# Altium schematic sheet GS_02_Pow.SchDoc: Title
size A1; Date: Date; CompanyName: Integrated Micro-Electronics Bulgaria; Organization: Design & Development Department; Address1: Drawing Type; Address2: Address 1; Address3: Address 2; Address4: Address 3; DocumentNumber: 730xxx; Revision: 01; SheetNumber: 1; SheetTotal: 1; PageSetup: Record=PageOptions|CenterHorizontal=True|CenterVertical=True|PrintScale=0.70|XCorrection=1.00|YCorrection=1.00|PrintKind=2|BorderSize=5000000|LeftOffset=0|BottomOffset=0|Orientation=2|PaperLength=1000|PaperWidth=1000|Scale=100|PaperSource=7|PrintQuality=-4|MediaType=1|DitherType=10|PaperKind=A4|PrintScaleMode=1; SheetSize: A3; Time: Time; ModifiedDate: Mod. Date
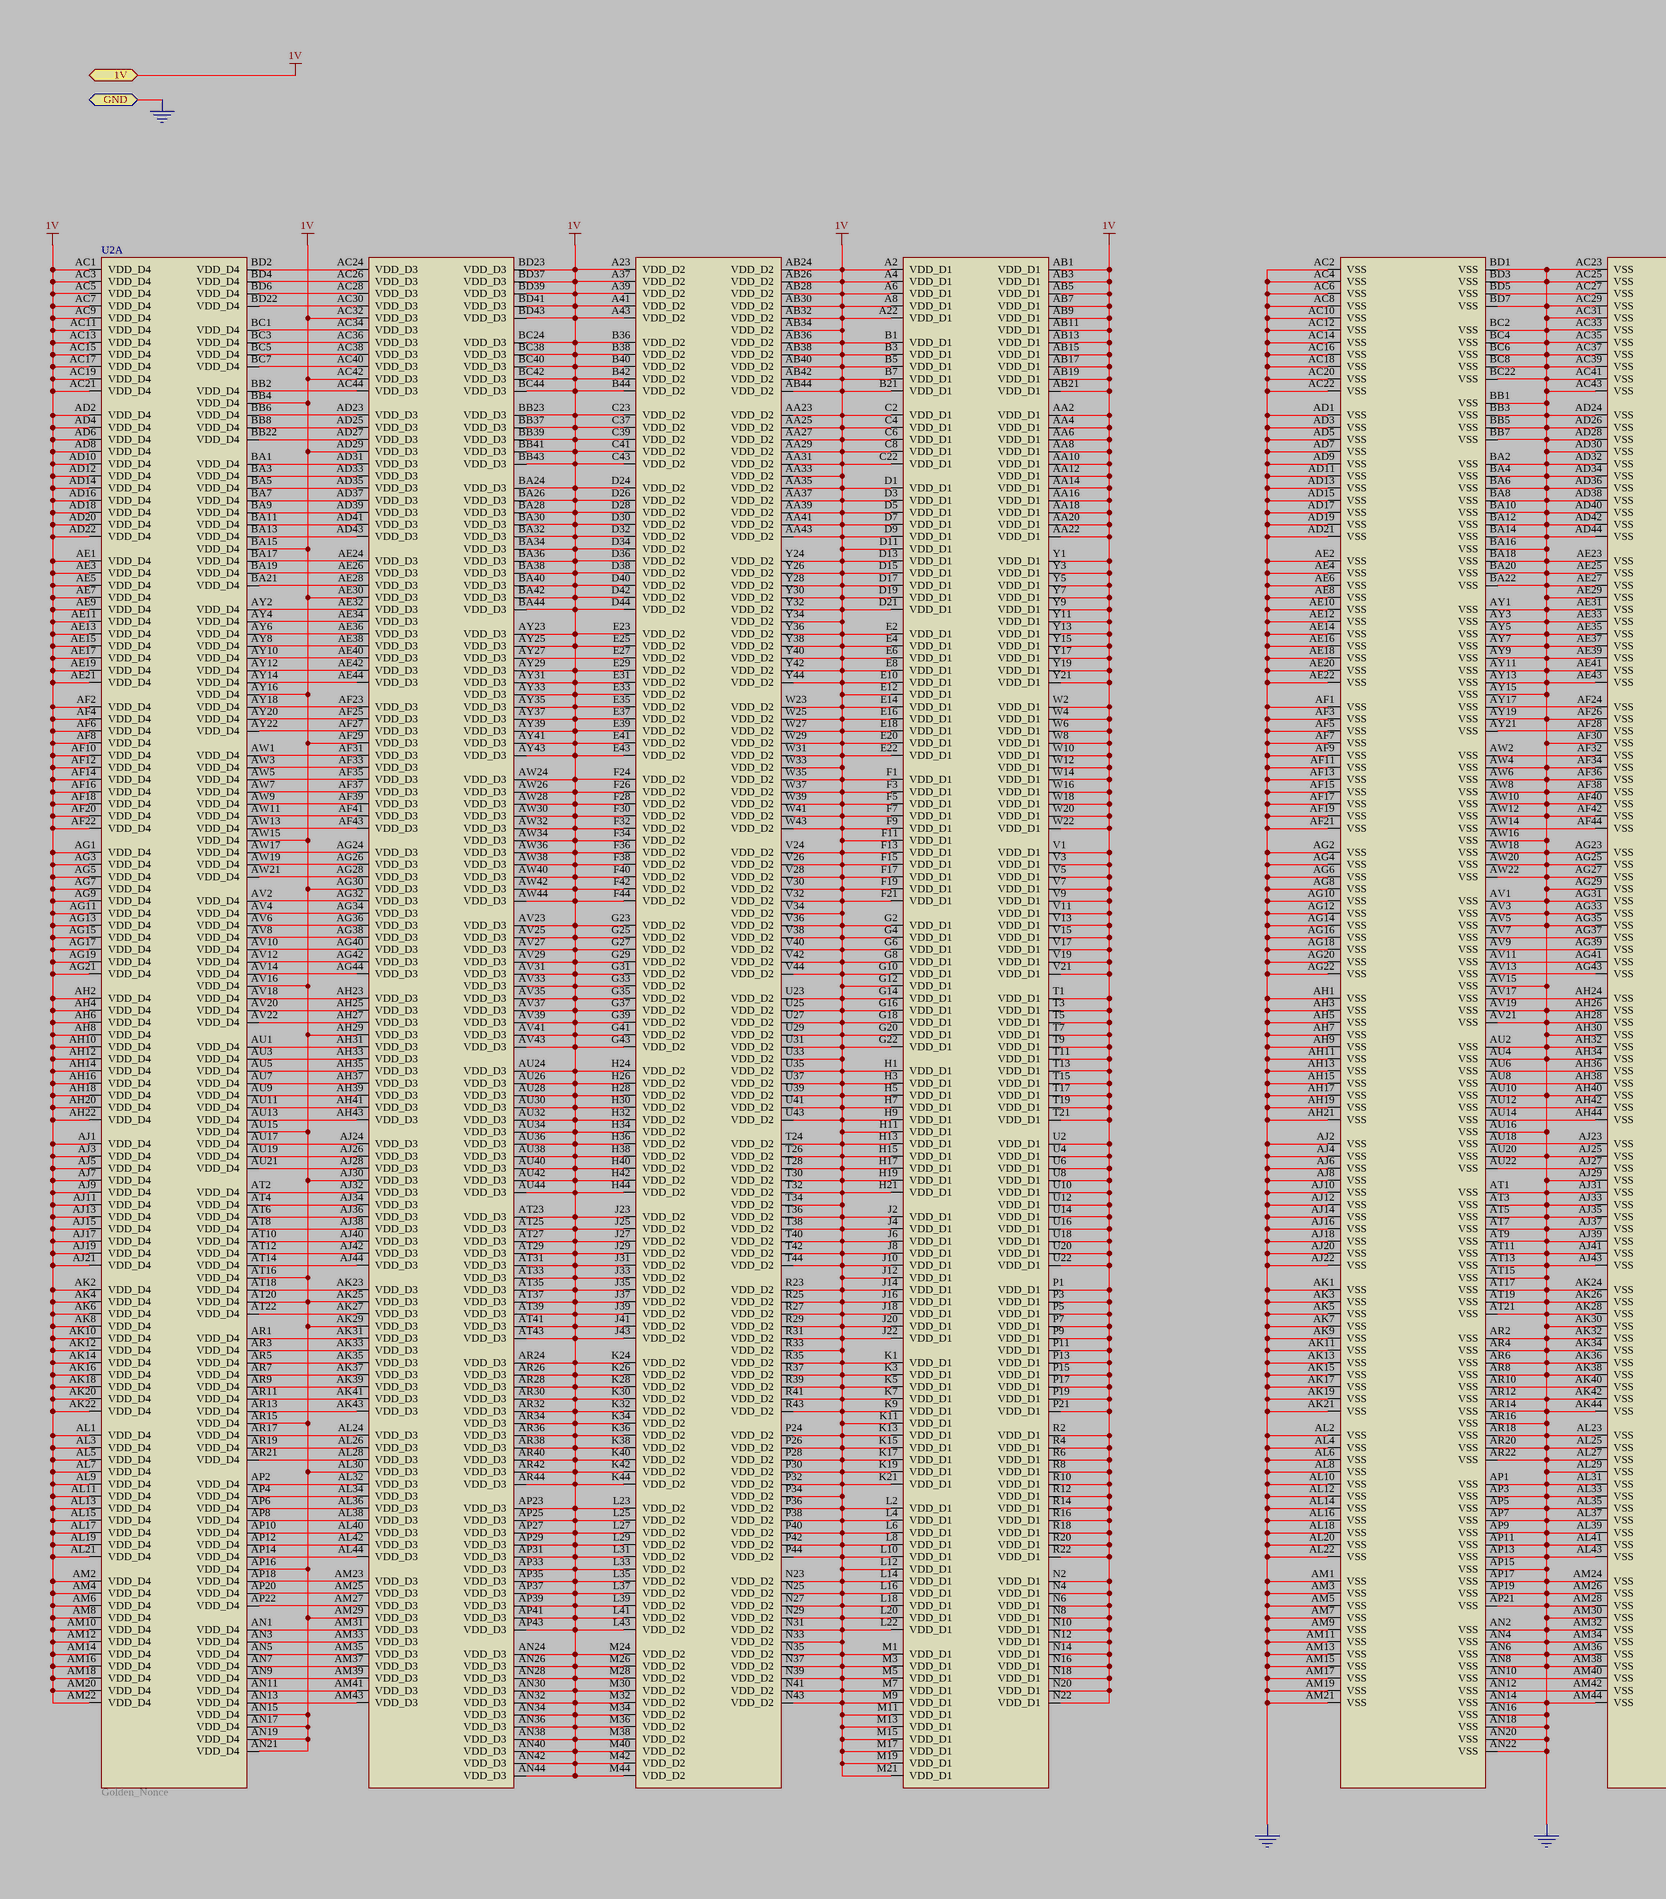
[diagram p0: GS_02_Pow.SchDoc, left]
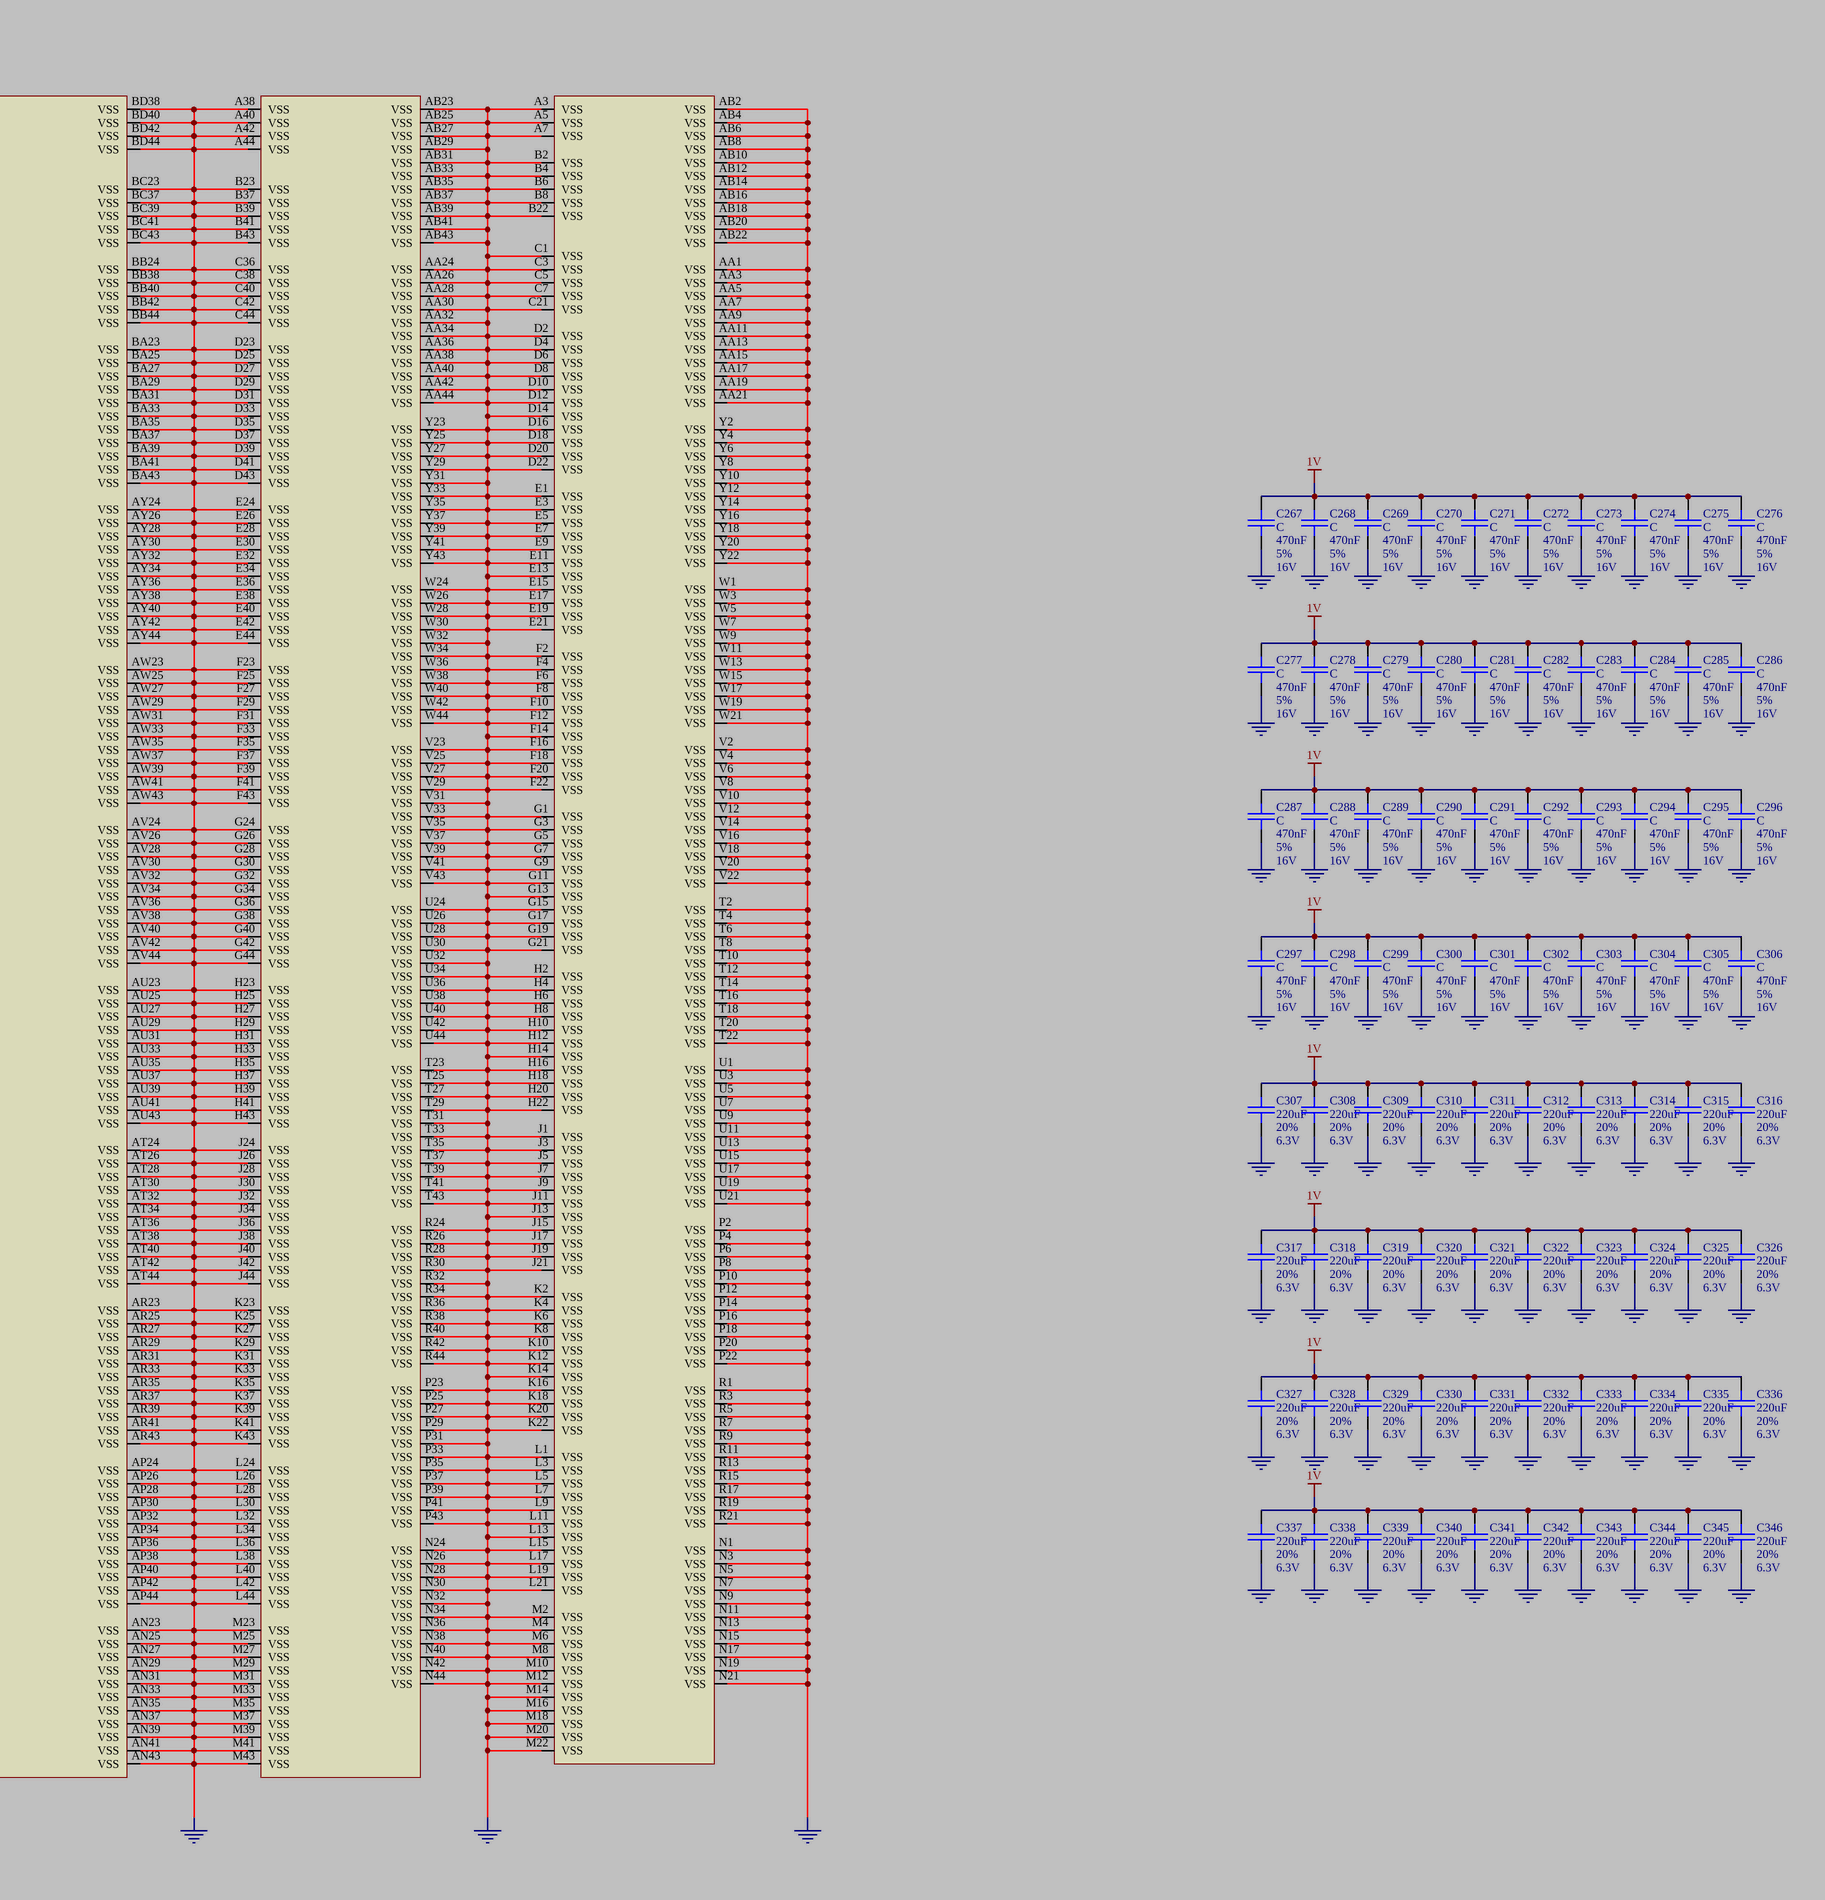
[diagram p1: GS_02_Pow.SchDoc, right]

## Parts
C267  C  DB_VALUE: 470nF  DB_TOLERANCE: 5%  DB_VOLTAGE: 16V  [SMD_0603_CAPC1608X95N]
C268  C  DB_VALUE: 470nF  DB_TOLERANCE: 5%  DB_VOLTAGE: 16V  [SMD_0603_CAPC1608X95N]
C269  C  DB_VALUE: 470nF  DB_TOLERANCE: 5%  DB_VOLTAGE: 16V  [SMD_0603_CAPC1608X95N]
C270  C  DB_VALUE: 470nF  DB_TOLERANCE: 5%  DB_VOLTAGE: 16V  [SMD_0603_CAPC1608X95N]
C271  C  DB_VALUE: 470nF  DB_TOLERANCE: 5%  DB_VOLTAGE: 16V  [SMD_0603_CAPC1608X95N]
C272  C  DB_VALUE: 470nF  DB_TOLERANCE: 5%  DB_VOLTAGE: 16V  [SMD_0603_CAPC1608X95N]
C273  C  DB_VALUE: 470nF  DB_TOLERANCE: 5%  DB_VOLTAGE: 16V  [SMD_0603_CAPC1608X95N]
C274  C  DB_VALUE: 470nF  DB_TOLERANCE: 5%  DB_VOLTAGE: 16V  [SMD_0603_CAPC1608X95N]
C275  C  DB_VALUE: 470nF  DB_TOLERANCE: 5%  DB_VOLTAGE: 16V  [SMD_0603_CAPC1608X95N]
C276  C  DB_VALUE: 470nF  DB_TOLERANCE: 5%  DB_VOLTAGE: 16V  [SMD_0603_CAPC1608X95N]
C277  C  DB_VALUE: 470nF  DB_TOLERANCE: 5%  DB_VOLTAGE: 16V  [SMD_0603_CAPC1608X95N]
C278  C  DB_VALUE: 470nF  DB_TOLERANCE: 5%  DB_VOLTAGE: 16V  [SMD_0603_CAPC1608X95N]
C279  C  DB_VALUE: 470nF  DB_TOLERANCE: 5%  DB_VOLTAGE: 16V  [SMD_0603_CAPC1608X95N]
C280  C  DB_VALUE: 470nF  DB_TOLERANCE: 5%  DB_VOLTAGE: 16V  [SMD_0603_CAPC1608X95N]
C281  C  DB_VALUE: 470nF  DB_TOLERANCE: 5%  DB_VOLTAGE: 16V  [SMD_0603_CAPC1608X95N]
C282  C  DB_VALUE: 470nF  DB_TOLERANCE: 5%  DB_VOLTAGE: 16V  [SMD_0603_CAPC1608X95N]
C283  C  DB_VALUE: 470nF  DB_TOLERANCE: 5%  DB_VOLTAGE: 16V  [SMD_0603_CAPC1608X95N]
C284  C  DB_VALUE: 470nF  DB_TOLERANCE: 5%  DB_VOLTAGE: 16V  [SMD_0603_CAPC1608X95N]
C285  C  DB_VALUE: 470nF  DB_TOLERANCE: 5%  DB_VOLTAGE: 16V  [SMD_0603_CAPC1608X95N]
C286  C  DB_VALUE: 470nF  DB_TOLERANCE: 5%  DB_VOLTAGE: 16V  [SMD_0603_CAPC1608X95N]
C287  C  DB_VALUE: 470nF  DB_TOLERANCE: 5%  DB_VOLTAGE: 16V  [SMD_0603_CAPC1608X95N]
C288  C  DB_VALUE: 470nF  DB_TOLERANCE: 5%  DB_VOLTAGE: 16V  [SMD_0603_CAPC1608X95N]
C289  C  DB_VALUE: 470nF  DB_TOLERANCE: 5%  DB_VOLTAGE: 16V  [SMD_0603_CAPC1608X95N]
C290  C  DB_VALUE: 470nF  DB_TOLERANCE: 5%  DB_VOLTAGE: 16V  [SMD_0603_CAPC1608X95N]
C291  C  DB_VALUE: 470nF  DB_TOLERANCE: 5%  DB_VOLTAGE: 16V  [SMD_0603_CAPC1608X95N]
C292  C  DB_VALUE: 470nF  DB_TOLERANCE: 5%  DB_VOLTAGE: 16V  [SMD_0603_CAPC1608X95N]
C293  C  DB_VALUE: 470nF  DB_TOLERANCE: 5%  DB_VOLTAGE: 16V  [SMD_0603_CAPC1608X95N]
C294  C  DB_VALUE: 470nF  DB_TOLERANCE: 5%  DB_VOLTAGE: 16V  [SMD_0603_CAPC1608X95N]
C295  C  DB_VALUE: 470nF  DB_TOLERANCE: 5%  DB_VOLTAGE: 16V  [SMD_0603_CAPC1608X95N]
C296  C  DB_VALUE: 470nF  DB_TOLERANCE: 5%  DB_VOLTAGE: 16V  [SMD_0603_CAPC1608X95N]
C297  C  DB_VALUE: 470nF  DB_TOLERANCE: 5%  DB_VOLTAGE: 16V  [SMD_0603_CAPC1608X95N]
C298  C  DB_VALUE: 470nF  DB_TOLERANCE: 5%  DB_VOLTAGE: 16V  [SMD_0603_CAPC1608X95N]
C299  C  DB_VALUE: 470nF  DB_TOLERANCE: 5%  DB_VOLTAGE: 16V  [SMD_0603_CAPC1608X95N]
C300  C  DB_VALUE: 470nF  DB_TOLERANCE: 5%  DB_VOLTAGE: 16V  [SMD_0603_CAPC1608X95N]
C301  C  DB_VALUE: 470nF  DB_TOLERANCE: 5%  DB_VOLTAGE: 16V  [SMD_0603_CAPC1608X95N]
C302  C  DB_VALUE: 470nF  DB_TOLERANCE: 5%  DB_VOLTAGE: 16V  [SMD_0603_CAPC1608X95N]
C303  C  DB_VALUE: 470nF  DB_TOLERANCE: 5%  DB_VOLTAGE: 16V  [SMD_0603_CAPC1608X95N]
C304  C  DB_VALUE: 470nF  DB_TOLERANCE: 5%  DB_VOLTAGE: 16V  [SMD_0603_CAPC1608X95N]
C305  C  DB_VALUE: 470nF  DB_TOLERANCE: 5%  DB_VOLTAGE: 16V  [SMD_0603_CAPC1608X95N]
C306  C  DB_VALUE: 470nF  DB_TOLERANCE: 5%  DB_VOLTAGE: 16V  [SMD_0603_CAPC1608X95N]
C307  DB_VALUE: 220uF  DB_TOLERANCE: 20%  DB_VOLTAGE: 6.3V  [SMD_1210_CAPC3225X279N]  (hidden comment: C)
C308  DB_VALUE: 220uF  DB_TOLERANCE: 20%  DB_VOLTAGE: 6.3V  [SMD_1210_CAPC3225X279N]  (hidden comment: C)
C309  DB_VALUE: 220uF  DB_TOLERANCE: 20%  DB_VOLTAGE: 6.3V  [SMD_1210_CAPC3225X279N]  (hidden comment: C)
C310  DB_VALUE: 220uF  DB_TOLERANCE: 20%  DB_VOLTAGE: 6.3V  [SMD_1210_CAPC3225X279N]  (hidden comment: C)
C311  DB_VALUE: 220uF  DB_TOLERANCE: 20%  DB_VOLTAGE: 6.3V  [SMD_1210_CAPC3225X279N]  (hidden comment: C)
C312  DB_VALUE: 220uF  DB_TOLERANCE: 20%  DB_VOLTAGE: 6.3V  [SMD_1210_CAPC3225X279N]  (hidden comment: C)
C313  DB_VALUE: 220uF  DB_TOLERANCE: 20%  DB_VOLTAGE: 6.3V  [SMD_1210_CAPC3225X279N]  (hidden comment: C)
C314  DB_VALUE: 220uF  DB_TOLERANCE: 20%  DB_VOLTAGE: 6.3V  [SMD_1210_CAPC3225X279N]  (hidden comment: C)
C315  DB_VALUE: 220uF  DB_TOLERANCE: 20%  DB_VOLTAGE: 6.3V  [SMD_1210_CAPC3225X279N]  (hidden comment: C)
C316  DB_VALUE: 220uF  DB_TOLERANCE: 20%  DB_VOLTAGE: 6.3V  [SMD_1210_CAPC3225X279N]  (hidden comment: C)
C317  DB_VALUE: 220uF  DB_TOLERANCE: 20%  DB_VOLTAGE: 6.3V  [SMD_1210_CAPC3225X279N]  (hidden comment: C)
C318  DB_VALUE: 220uF  DB_TOLERANCE: 20%  DB_VOLTAGE: 6.3V  [SMD_1210_CAPC3225X279N]  (hidden comment: C)
C319  DB_VALUE: 220uF  DB_TOLERANCE: 20%  DB_VOLTAGE: 6.3V  [SMD_1210_CAPC3225X279N]  (hidden comment: C)
C320  DB_VALUE: 220uF  DB_TOLERANCE: 20%  DB_VOLTAGE: 6.3V  [SMD_1210_CAPC3225X279N]  (hidden comment: C)
C321  DB_VALUE: 220uF  DB_TOLERANCE: 20%  DB_VOLTAGE: 6.3V  [SMD_1210_CAPC3225X279N]  (hidden comment: C)
C322  DB_VALUE: 220uF  DB_TOLERANCE: 20%  DB_VOLTAGE: 6.3V  [SMD_1210_CAPC3225X279N]  (hidden comment: C)
C323  DB_VALUE: 220uF  DB_TOLERANCE: 20%  DB_VOLTAGE: 6.3V  [SMD_1210_CAPC3225X279N]  (hidden comment: C)
C324  DB_VALUE: 220uF  DB_TOLERANCE: 20%  DB_VOLTAGE: 6.3V  [SMD_1210_CAPC3225X279N]  (hidden comment: C)
C325  DB_VALUE: 220uF  DB_TOLERANCE: 20%  DB_VOLTAGE: 6.3V  [SMD_1210_CAPC3225X279N]  (hidden comment: C)
C326  DB_VALUE: 220uF  DB_TOLERANCE: 20%  DB_VOLTAGE: 6.3V  [SMD_1210_CAPC3225X279N]  (hidden comment: C)
C327  DB_VALUE: 220uF  DB_TOLERANCE: 20%  DB_VOLTAGE: 6.3V  [SMD_1210_CAPC3225X279N]  (hidden comment: C)
C328  DB_VALUE: 220uF  DB_TOLERANCE: 20%  DB_VOLTAGE: 6.3V  [SMD_1210_CAPC3225X279N]  (hidden comment: C)
C329  DB_VALUE: 220uF  DB_TOLERANCE: 20%  DB_VOLTAGE: 6.3V  [SMD_1210_CAPC3225X279N]  (hidden comment: C)
C330  DB_VALUE: 220uF  DB_TOLERANCE: 20%  DB_VOLTAGE: 6.3V  [SMD_1210_CAPC3225X279N]  (hidden comment: C)
C331  DB_VALUE: 220uF  DB_TOLERANCE: 20%  DB_VOLTAGE: 6.3V  [SMD_1210_CAPC3225X279N]  (hidden comment: C)
C332  DB_VALUE: 220uF  DB_TOLERANCE: 20%  DB_VOLTAGE: 6.3V  [SMD_1210_CAPC3225X279N]  (hidden comment: C)
C333  DB_VALUE: 220uF  DB_TOLERANCE: 20%  DB_VOLTAGE: 6.3V  [SMD_1210_CAPC3225X279N]  (hidden comment: C)
C334  DB_VALUE: 220uF  DB_TOLERANCE: 20%  DB_VOLTAGE: 6.3V  [SMD_1210_CAPC3225X279N]  (hidden comment: C)
C335  DB_VALUE: 220uF  DB_TOLERANCE: 20%  DB_VOLTAGE: 6.3V  [SMD_1210_CAPC3225X279N]  (hidden comment: C)
C336  DB_VALUE: 220uF  DB_TOLERANCE: 20%  DB_VOLTAGE: 6.3V  [SMD_1210_CAPC3225X279N]  (hidden comment: C)
C337  DB_VALUE: 220uF  DB_TOLERANCE: 20%  DB_VOLTAGE: 6.3V  [SMD_1210_CAPC3225X279N]  (hidden comment: C)
C338  DB_VALUE: 220uF  DB_TOLERANCE: 20%  DB_VOLTAGE: 6.3V  [SMD_1210_CAPC3225X279N]  (hidden comment: C)
C339  DB_VALUE: 220uF  DB_TOLERANCE: 20%  DB_VOLTAGE: 6.3V  [SMD_1210_CAPC3225X279N]  (hidden comment: C)
C340  DB_VALUE: 220uF  DB_TOLERANCE: 20%  DB_VOLTAGE: 6.3V  [SMD_1210_CAPC3225X279N]  (hidden comment: C)
C341  DB_VALUE: 220uF  DB_TOLERANCE: 20%  DB_VOLTAGE: 6.3V  [SMD_1210_CAPC3225X279N]  (hidden comment: C)
C342  DB_VALUE: 220uF  DB_TOLERANCE: 20%  DB_VOLTAGE: 6.3V  [SMD_1210_CAPC3225X279N]  (hidden comment: C)
C343  DB_VALUE: 220uF  DB_TOLERANCE: 20%  DB_VOLTAGE: 6.3V  [SMD_1210_CAPC3225X279N]  (hidden comment: C)
C344  DB_VALUE: 220uF  DB_TOLERANCE: 20%  DB_VOLTAGE: 6.3V  [SMD_1210_CAPC3225X279N]  (hidden comment: C)
C345  DB_VALUE: 220uF  DB_TOLERANCE: 20%  DB_VOLTAGE: 6.3V  [SMD_1210_CAPC3225X279N]  (hidden comment: C)
C346  DB_VALUE: 220uF  DB_TOLERANCE: 20%  DB_VOLTAGE: 6.3V  [SMD_1210_CAPC3225X279N]  (hidden comment: C)
U2  Golden_Nonce  (part A of 5)

## Ports
1V, GND

## Nets
1V: C267.2 C268.2 C269.2 C270.2 C271.2 C272.2 C273.2 C274.2 C275.2 C276.2 C277.2 C278.2 C279.2 C280.2 C281.2 C282.2 C283.2 C284.2 C285.2 C286.2 C287.2 C288.2 C289.2 C290.2 C291.2 C292.2 C293.2 C294.2 C295.2 C296.2 C297.2 C298.2 C299.2 C300.2 C301.2 C302.2 C303.2 C304.2 C305.2 C306.2 C307.2 C308.2 C309.2 C310.2 C311.2 C312.2 C313.2 C314.2 C315.2 C316.2 C317.2 C318.2 C319.2 C320.2 C321.2 C322.2 C323.2 C324.2 C325.2 C326.2 C327.2 C328.2 C329.2 C330.2 C331.2 C332.2 C333.2 C334.2 C335.2 C336.2 C337.2 C338.2 C339.2 C340.2 C341.2 C342.2 C343.2 C344.2 C345.2 C346.2 U2.A2(VDD_D1) U2.A4(VDD_D1) U2.A6(VDD_D1) U2.A8(VDD_D1) U2.A22(VDD_D1) U2.A23(VDD_D2) U2.A37(VDD_D2) U2.A39(VDD_D2) U2.A41(VDD_D2) U2.A43(VDD_D2) U2.AA2(VDD_D1) U2.AA4(VDD_D1) U2.AA6(VDD_D1) U2.AA8(VDD_D1) U2.AA10(VDD_D1) U2.AA12(VDD_D1) U2.AA14(VDD_D1) U2.AA16(VDD_D1) U2.AA18(VDD_D1) U2.AA20(VDD_D1) U2.AA22(VDD_D1) U2.AA23(VDD_D2) U2.AA25(VDD_D2) U2.AA27(VDD_D2) U2.AA29(VDD_D2) U2.AA31(VDD_D2) U2.AA33(VDD_D2) U2.AA35(VDD_D2) U2.AA37(VDD_D2) U2.AA39(VDD_D2) U2.AA41(VDD_D2) U2.AA43(VDD_D2) U2.AB1(VDD_D1) U2.AB3(VDD_D1) U2.AB5(VDD_D1) U2.AB7(VDD_D1) U2.AB9(VDD_D1) U2.AB11(VDD_D1) U2.AB13(VDD_D1) U2.AB15(VDD_D1) U2.AB17(VDD_D1) U2.AB19(VDD_D1) U2.AB21(VDD_D1) U2.AB24(VDD_D2) U2.AB26(VDD_D2) U2.AB28(VDD_D2) U2.AB30(VDD_D2) U2.AB32(VDD_D2) U2.AB34(VDD_D2) U2.AB36(VDD_D2) U2.AB38(VDD_D2) U2.AB40(VDD_D2) U2.AB42(VDD_D2) U2.AB44(VDD_D2) U2.AC1(VDD_D4) U2.AC3(VDD_D4) U2.AC5(VDD_D4) U2.AC7(VDD_D4) U2.AC9(VDD_D4) U2.AC11(VDD_D4) U2.AC13(VDD_D4) U2.AC15(VDD_D4) U2.AC17(VDD_D4) U2.AC19(VDD_D4) U2.AC21(VDD_D4) U2.AC32(VDD_D3) U2.AC42(VDD_D3) U2.AD2(VDD_D4) U2.AD4(VDD_D4) U2.AD6(VDD_D4) U2.AD8(VDD_D4) U2.AD10(VDD_D4) U2.AD12(VDD_D4) U2.AD14(VDD_D4) U2.AD16(VDD_D4) U2.AD18(VDD_D4) U2.AD20(VDD_D4) U2.AD22(VDD_D4) U2.AD29(VDD_D3) U2.AE1(VDD_D4) U2.AE3(VDD_D4) U2.AE5(VDD_D4) U2.AE7(VDD_D4) U2.AE9(VDD_D4) U2.AE11(VDD_D4) U2.AE13(VDD_D4) U2.AE15(VDD_D4) U2.AE17(VDD_D4) U2.AE19(VDD_D4) U2.AE21(VDD_D4) U2.AE30(VDD_D3) U2.AF2(VDD_D4) U2.AF4(VDD_D4) U2.AF6(VDD_D4) U2.AF8(VDD_D4) U2.AF10(VDD_D4) U2.AF12(VDD_D4) U2.AF14(VDD_D4) U2.AF16(VDD_D4) U2.AF18(VDD_D4) U2.AF20(VDD_D4) U2.AF22(VDD_D4) U2.AF29(VDD_D3) U2.AG1(VDD_D4) U2.AG3(VDD_D4) U2.AG5(VDD_D4) U2.AG7(VDD_D4) U2.AG9(VDD_D4) U2.AG11(VDD_D4) U2.AG13(VDD_D4) U2.AG15(VDD_D4) U2.AG17(VDD_D4) U2.AG19(VDD_D4) U2.AG21(VDD_D4) U2.AG30(VDD_D3) U2.AH2(VDD_D4) U2.AH4(VDD_D4) U2.AH6(VDD_D4) U2.AH8(VDD_D4) U2.AH10(VDD_D4) U2.AH12(VDD_D4) U2.AH14(VDD_D4) U2.AH16(VDD_D4) U2.AH18(VDD_D4) U2.AH20(VDD_D4) U2.AH22(VDD_D4) U2.AH29(VDD_D3) U2.AJ1(VDD_D4) U2.AJ3(VDD_D4) U2.AJ5(VDD_D4) U2.AJ7(VDD_D4) U2.AJ9(VDD_D4) U2.AJ11(VDD_D4) U2.AJ13(VDD_D4) U2.AJ15(VDD_D4) U2.AJ17(VDD_D4) U2.AJ19(VDD_D4) U2.AJ21(VDD_D4) U2.AJ30(VDD_D3) U2.AK2(VDD_D4) U2.AK4(VDD_D4) U2.AK6(VDD_D4) U2.AK8(VDD_D4) U2.AK10(VDD_D4) U2.AK12(VDD_D4) U2.AK14(VDD_D4) U2.AK16(VDD_D4) U2.AK18(VDD_D4) U2.AK20(VDD_D4) U2.AK22(VDD_D4) U2.AK25(VDD_D3) U2.AK29(VDD_D3) U2.AL1(VDD_D4) U2.AL3(VDD_D4) U2.AL5(VDD_D4) U2.AL7(VDD_D4) U2.AL9(VDD_D4) U2.AL11(VDD_D4) U2.AL13(VDD_D4) U2.AL15(VDD_D4) U2.AL17(VDD_D4) U2.AL19(VDD_D4) U2.AL21(VDD_D4) U2.AL30(VDD_D3) U2.AM2(VDD_D4) U2.AM4(VDD_D4) U2.AM6(VDD_D4) U2.AM8(VDD_D4) U2.AM10(VDD_D4) U2.AM12(VDD_D4) U2.AM14(VDD_D4) U2.AM16(VDD_D4) U2.AM18(VDD_D4) U2.AM20(VDD_D4) U2.AM22(VDD_D4) U2.AM29(VDD_D3) U2.AN15(VDD_D4) U2.AN17(VDD_D4) U2.AN19(VDD_D4) U2.AN21(VDD_D4) U2.AN24(VDD_D3) U2.AN26(VDD_D3) U2.AN28(VDD_D3) U2.AN30(VDD_D3) U2.AN32(VDD_D3) U2.AN34(VDD_D3) U2.AN36(VDD_D3) U2.AN38(VDD_D3) U2.AN40(VDD_D3) U2.AN42(VDD_D3) U2.AN44(VDD_D3) U2.AP16(VDD_D4) U2.AP23(VDD_D3) U2.AP25(VDD_D3) U2.AP27(VDD_D3) U2.AP29(VDD_D3) U2.AP31(VDD_D3) U2.AP33(VDD_D3) U2.AP35(VDD_D3) U2.AP37(VDD_D3) U2.AP39(VDD_D3) U2.AP41(VDD_D3) U2.AP43(VDD_D3) U2.AR15(VDD_D4) U2.AR24(VDD_D3) U2.AR26(VDD_D3) U2.AR28(VDD_D3) U2.AR30(VDD_D3) U2.AR32(VDD_D3) U2.AR34(VDD_D3) U2.AR36(VDD_D3) U2.AR38(VDD_D3) U2.AR40(VDD_D3) U2.AR42(VDD_D3) U2.AR44(VDD_D3) U2.AT16(VDD_D4) U2.AT20(VDD_D4) U2.AT23(VDD_D3) U2.AT25(VDD_D3) U2.AT27(VDD_D3) U2.AT29(VDD_D3) U2.AT31(VDD_D3) U2.AT33(VDD_D3) U2.AT35(VDD_D3) U2.AT37(VDD_D3) U2.AT39(VDD_D3) U2.AT41(VDD_D3) U2.AT43(VDD_D3) U2.AU15(VDD_D4) U2.AU24(VDD_D3) U2.AU26(VDD_D3) U2.AU28(VDD_D3) U2.AU30(VDD_D3) U2.AU32(VDD_D3) U2.AU34(VDD_D3) U2.AU36(VDD_D3) U2.AU38(VDD_D3) U2.AU40(VDD_D3) U2.AU42(VDD_D3) U2.AU44(VDD_D3) U2.AV16(VDD_D4) U2.AV23(VDD_D3) U2.AV25(VDD_D3) U2.AV27(VDD_D3) U2.AV29(VDD_D3) U2.AV31(VDD_D3) U2.AV33(VDD_D3) U2.AV35(VDD_D3) U2.AV37(VDD_D3) U2.AV39(VDD_D3) U2.AV41(VDD_D3) U2.AV43(VDD_D3) U2.AW15(VDD_D4) U2.AW24(VDD_D3) U2.AW26(VDD_D3) U2.AW28(VDD_D3) U2.AW30(VDD_D3) U2.AW32(VDD_D3) U2.AW34(VDD_D3) U2.AW36(VDD_D3) U2.AW38(VDD_D3) U2.AW40(VDD_D3) U2.AW42(VDD_D3) U2.AW44(VDD_D3) U2.AY16(VDD_D4) U2.AY23(VDD_D3) U2.AY25(VDD_D3) U2.AY29(VDD_D3) U2.AY31(VDD_D3) U2.AY33(VDD_D3) U2.AY35(VDD_D3) U2.AY37(VDD_D3) U2.AY39(VDD_D3) U2.AY41(VDD_D3) U2.AY43(VDD_D3) U2.B1(VDD_D1) U2.B3(VDD_D1) U2.B5(VDD_D1) U2.B7(VDD_D1) U2.B21(VDD_D1) U2.B36(VDD_D2) U2.B38(VDD_D2) U2.B40(VDD_D2) U2.B42(VDD_D2) U2.B44(VDD_D2) U2.BA15(VDD_D4) U2.BA24(VDD_D3) U2.BA26(VDD_D3) U2.BA28(VDD_D3) U2.BA30(VDD_D3) U2.BA32(VDD_D3) U2.BA34(VDD_D3) U2.BA36(VDD_D3) U2.BA38(VDD_D3) U2.BA40(VDD_D3) U2.BA42(VDD_D3) U2.BA44(VDD_D3) U2.BB4(VDD_D4) U2.BB23(VDD_D3) U2.BB37(VDD_D3) U2.BB39(VDD_D3) U2.BB41(VDD_D3) U2.BB43(VDD_D3) U2.BC24(VDD_D3) U2.BC38(VDD_D3) U2.BC40(VDD_D3) U2.BC42(VDD_D3) U2.BC44(VDD_D3) U2.BD23(VDD_D3) U2.BD37(VDD_D3) U2.BD39(VDD_D3) U2.BD41(VDD_D3) U2.BD43(VDD_D3) U2.C2(VDD_D1) U2.C4(VDD_D1) U2.C6(VDD_D1) U2.C8(VDD_D1) U2.C22(VDD_D1) U2.C23(VDD_D2) U2.C37(VDD_D2) U2.C39(VDD_D2) U2.C41(VDD_D2) U2.C43(VDD_D2) U2.D1(VDD_D1) U2.D3(VDD_D1) U2.D5(VDD_D1) U2.D7(VDD_D1) U2.D9(VDD_D1) U2.D11(VDD_D1) U2.D13(VDD_D1) U2.D15(VDD_D1) U2.D17(VDD_D1) U2.D19(VDD_D1) U2.D21(VDD_D1) U2.D24(VDD_D2) U2.D26(VDD_D2) U2.D28(VDD_D2) U2.D30(VDD_D2) U2.D32(VDD_D2) U2.D34(VDD_D2) U2.D36(VDD_D2) U2.D38(VDD_D2) U2.D40(VDD_D2) U2.D42(VDD_D2) U2.D44(VDD_D2) U2.E2(VDD_D1) U2.E4(VDD_D1) U2.E6(VDD_D1) U2.E8(VDD_D1) U2.E10(VDD_D1) U2.E12(VDD_D1) U2.E14(VDD_D1) U2.E16(VDD_D1) U2.E18(VDD_D1) U2.E20(VDD_D1) U2.E22(VDD_D1) U2.E23(VDD_D2) U2.E25(VDD_D2) U2.E29(VDD_D2) U2.E31(VDD_D2) U2.E33(VDD_D2) U2.E35(VDD_D2) U2.E37(VDD_D2) U2.E39(VDD_D2) U2.E41(VDD_D2) U2.E43(VDD_D2) U2.F1(VDD_D1) U2.F3(VDD_D1) U2.F5(VDD_D1) U2.F7(VDD_D1) U2.F9(VDD_D1) U2.F11(VDD_D1) U2.F13(VDD_D1) U2.F15(VDD_D1) U2.F17(VDD_D1) U2.F19(VDD_D1) U2.F21(VDD_D1) U2.F24(VDD_D2) U2.F26(VDD_D2) U2.F28(VDD_D2) U2.F30(VDD_D2) U2.F32(VDD_D2) U2.F34(VDD_D2) U2.F36(VDD_D2) U2.F38(VDD_D2) U2.F40(VDD_D2) U2.F42(VDD_D2) U2.F44(VDD_D2) U2.G2(VDD_D1) U2.G4(VDD_D1) U2.G6(VDD_D1) U2.G8(VDD_D1) U2.G10(VDD_D1) U2.G12(VDD_D1) U2.G14(VDD_D1) U2.G16(VDD_D1) U2.G18(VDD_D1) U2.G20(VDD_D1) U2.G22(VDD_D1) U2.G23(VDD_D2) U2.G25(VDD_D2) U2.G27(VDD_D2) U2.G29(VDD_D2) U2.G31(VDD_D2) U2.G33(VDD_D2) U2.G35(VDD_D2) U2.G37(VDD_D2) U2.G39(VDD_D2) U2.G41(VDD_D2) U2.G43(VDD_D2) U2.H1(VDD_D1) U2.H3(VDD_D1) U2.H5(VDD_D1) U2.H7(VDD_D1) U2.H9(VDD_D1) U2.H11(VDD_D1) U2.H13(VDD_D1) U2.H15(VDD_D1) U2.H17(VDD_D1) U2.H19(VDD_D1) U2.H21(VDD_D1) U2.H24(VDD_D2) U2.H26(VDD_D2) U2.H28(VDD_D2) U2.H30(VDD_D2) U2.H32(VDD_D2) U2.H34(VDD_D2) U2.H36(VDD_D2) U2.H38(VDD_D2) U2.H40(VDD_D2) U2.H42(VDD_D2) U2.H44(VDD_D2) U2.J2(VDD_D1) U2.J4(VDD_D1) U2.J6(VDD_D1) U2.J8(VDD_D1) U2.J10(VDD_D1) U2.J12(VDD_D1) U2.J14(VDD_D1) U2.J16(VDD_D1) U2.J18(VDD_D1) U2.J20(VDD_D1) U2.J22(VDD_D1) U2.J23(VDD_D2) U2.J25(VDD_D2) U2.J27(VDD_D2) U2.J29(VDD_D2) U2.J31(VDD_D2) U2.J33(VDD_D2) U2.J35(VDD_D2) U2.J37(VDD_D2) U2.J39(VDD_D2) U2.J41(VDD_D2) U2.J43(VDD_D2) U2.K1(VDD_D1) U2.K3(VDD_D1) U2.K5(VDD_D1) U2.K7(VDD_D1) U2.K9(VDD_D1) U2.K11(VDD_D1) U2.K13(VDD_D1) U2.K15(VDD_D1) U2.K17(VDD_D1) U2.K19(VDD_D1) U2.K21(VDD_D1) U2.K24(VDD_D2) U2.K26(VDD_D2) U2.K28(VDD_D2) U2.K30(VDD_D2) U2.K32(VDD_D2) U2.K34(VDD_D2) U2.K36(VDD_D2) U2.K38(VDD_D2) U2.K40(VDD_D2) U2.K42(VDD_D2) U2.K44(VDD_D2) U2.L2(VDD_D1) U2.L4(VDD_D1) U2.L6(VDD_D1) U2.L8(VDD_D1) U2.L10(VDD_D1) U2.L12(VDD_D1) U2.L14(VDD_D1) U2.L16(VDD_D1) U2.L18(VDD_D1) U2.L20(VDD_D1) U2.L22(VDD_D1) U2.L23(VDD_D2) U2.L25(VDD_D2) U2.L27(VDD_D2) U2.L29(VDD_D2) U2.L31(VDD_D2) U2.L33(VDD_D2) U2.L35(VDD_D2) U2.L37(VDD_D2) U2.L39(VDD_D2) U2.L41(VDD_D2) U2.L43(VDD_D2) U2.M1(VDD_D1) U2.M3(VDD_D1) U2.M5(VDD_D1) U2.M7(VDD_D1) U2.M9(VDD_D1) U2.M11(VDD_D1) U2.M13(VDD_D1) U2.M15(VDD_D1) U2.M17(VDD_D1) U2.M19(VDD_D1) U2.M21(VDD_D1) U2.M24(VDD_D2) U2.M26(VDD_D2) U2.M28(VDD_D2) U2.M30(VDD_D2) U2.M32(VDD_D2) U2.M34(VDD_D2) U2.M36(VDD_D2) U2.M38(VDD_D2) U2.M40(VDD_D2) U2.M42(VDD_D2) U2.M44(VDD_D2) U2.N2(VDD_D1) U2.N4(VDD_D1) U2.N6(VDD_D1) U2.N8(VDD_D1) U2.N10(VDD_D1) U2.N12(VDD_D1) U2.N14(VDD_D1) U2.N16(VDD_D1) U2.N18(VDD_D1) U2.N20(VDD_D1) U2.N22(VDD_D1) U2.N23(VDD_D2) U2.N25(VDD_D2) U2.N27(VDD_D2) U2.N29(VDD_D2) U2.N31(VDD_D2) U2.N33(VDD_D2) U2.N35(VDD_D2) U2.N37(VDD_D2) U2.N39(VDD_D2) U2.N41(VDD_D2) U2.N43(VDD_D2) U2.P1(VDD_D1) U2.P3(VDD_D1) U2.P5(VDD_D1) U2.P7(VDD_D1) U2.P9(VDD_D1) U2.P11(VDD_D1) U2.P13(VDD_D1) U2.P15(VDD_D1) U2.P17(VDD_D1) U2.P19(VDD_D1) U2.P21(VDD_D1) U2.P24(VDD_D2) U2.P26(VDD_D2) U2.P28(VDD_D2) U2.P30(VDD_D2) U2.P32(VDD_D2) U2.P34(VDD_D2) U2.P36(VDD_D2) U2.P38(VDD_D2) U2.P40(VDD_D2) U2.P42(VDD_D2) U2.P44(VDD_D2) U2.R2(VDD_D1) U2.R4(VDD_D1) U2.R6(VDD_D1) U2.R8(VDD_D1) U2.R10(VDD_D1) U2.R12(VDD_D1) U2.R14(VDD_D1) U2.R16(VDD_D1) U2.R18(VDD_D1) U2.R20(VDD_D1) U2.R22(VDD_D1) U2.R23(VDD_D2) U2.R25(VDD_D2) U2.R27(VDD_D2) U2.R29(VDD_D2) U2.R31(VDD_D2) U2.R33(VDD_D2) U2.R35(VDD_D2) U2.R37(VDD_D2) U2.R39(VDD_D2) U2.R41(VDD_D2) U2.R43(VDD_D2) U2.T1(VDD_D1) U2.T3(VDD_D1) U2.T5(VDD_D1) U2.T7(VDD_D1) U2.T9(VDD_D1) U2.T11(VDD_D1) U2.T13(VDD_D1) U2.T15(VDD_D1) U2.T17(VDD_D1) U2.T19(VDD_D1) U2.T21(VDD_D1) U2.T24(VDD_D2) U2.T26(VDD_D2) U2.T28(VDD_D2) U2.T30(VDD_D2) U2.T32(VDD_D2) U2.T34(VDD_D2) U2.T36(VDD_D2) U2.T38(VDD_D2) U2.T40(VDD_D2) U2.T42(VDD_D2) U2.T44(VDD_D2) U2.U2(VDD_D1) U2.U4(VDD_D1) U2.U6(VDD_D1) U2.U8(VDD_D1) U2.U10(VDD_D1) U2.U12(VDD_D1) U2.U14(VDD_D1) U2.U16(VDD_D1) U2.U18(VDD_D1) U2.U20(VDD_D1) U2.U22(VDD_D1) U2.U23(VDD_D2) U2.U25(VDD_D2) U2.U27(VDD_D2) U2.U29(VDD_D2) U2.U31(VDD_D2) U2.U33(VDD_D2) U2.U35(VDD_D2) U2.U37(VDD_D2) U2.U39(VDD_D2) U2.U41(VDD_D2) U2.U43(VDD_D2) U2.V1(VDD_D1) U2.V3(VDD_D1) U2.V5(VDD_D1) U2.V7(VDD_D1) U2.V9(VDD_D1) U2.V11(VDD_D1) U2.V13(VDD_D1) U2.V15(VDD_D1) U2.V17(VDD_D1) U2.V19(VDD_D1) U2.V21(VDD_D1) U2.V24(VDD_D2) U2.V26(VDD_D2) U2.V28(VDD_D2) U2.V30(VDD_D2) U2.V32(VDD_D2) U2.V34(VDD_D2) U2.V36(VDD_D2) U2.V38(VDD_D2) U2.V40(VDD_D2) U2.V42(VDD_D2) U2.V44(VDD_D2) U2.W2(VDD_D1) U2.W4(VDD_D1) U2.W6(VDD_D1) U2.W8(VDD_D1) U2.W10(VDD_D1) U2.W12(VDD_D1) U2.W14(VDD_D1) U2.W16(VDD_D1) U2.W18(VDD_D1) U2.W20(VDD_D1) U2.W22(VDD_D1) U2.W23(VDD_D2) U2.W25(VDD_D2) U2.W27(VDD_D2) U2.W29(VDD_D2) U2.W31(VDD_D2) U2.W33(VDD_D2) U2.W35(VDD_D2) U2.W37(VDD_D2) U2.W39(VDD_D2) U2.W41(VDD_D2) U2.W43(VDD_D2) U2.Y1(VDD_D1) U2.Y3(VDD_D1) U2.Y5(VDD_D1) U2.Y7(VDD_D1) U2.Y9(VDD_D1) U2.Y11(VDD_D1) U2.Y13(VDD_D1) U2.Y15(VDD_D1) U2.Y17(VDD_D1) U2.Y19(VDD_D1) U2.Y21(VDD_D1) U2.Y24(VDD_D2) U2.Y26(VDD_D2) U2.Y28(VDD_D2) U2.Y30(VDD_D2) U2.Y32(VDD_D2) U2.Y34(VDD_D2) U2.Y36(VDD_D2) U2.Y38(VDD_D2) U2.Y40(VDD_D2) U2.Y42(VDD_D2) U2.Y44(VDD_D2) ; port 1V
GND: C267.1 C268.1 C269.1 C270.1 C271.1 C272.1 C273.1 C274.1 C275.1 C276.1 C277.1 C278.1 C279.1 C280.1 C281.1 C282.1 C283.1 C284.1 C285.1 C286.1 C287.1 C288.1 C289.1 C290.1 C291.1 C292.1 C293.1 C294.1 C295.1 C296.1 C297.1 C298.1 C299.1 C300.1 C301.1 C302.1 C303.1 C304.1 C305.1 C306.1 C307.1 C308.1 C309.1 C310.1 C311.1 C312.1 C313.1 C314.1 C315.1 C316.1 C317.1 C318.1 C319.1 C320.1 C321.1 C322.1 C323.1 C324.1 C325.1 C326.1 C327.1 C328.1 C329.1 C330.1 C331.1 C332.1 C333.1 C334.1 C335.1 C336.1 C337.1 C338.1 C339.1 C340.1 C341.1 C342.1 C343.1 C344.1 C345.1 C346.1 U2.A3(VSS) U2.A5(VSS) U2.A7(VSS) U2.A38(VSS) U2.A40(VSS) U2.A42(VSS) U2.A44(VSS) U2.AA1(VSS) U2.AA3(VSS) U2.AA5(VSS) U2.AA7(VSS) U2.AA9(VSS) U2.AA11(VSS) U2.AA13(VSS) U2.AA15(VSS) U2.AA17(VSS) U2.AA19(VSS) U2.AA21(VSS) U2.AA24(VSS) U2.AA26(VSS) U2.AA28(VSS) U2.AA30(VSS) U2.AA32(VSS) U2.AA34(VSS) U2.AA36(VSS) U2.AA38(VSS) U2.AA40(VSS) U2.AA42(VSS) U2.AA44(VSS) U2.AB2(VSS) U2.AB4(VSS) U2.AB6(VSS) U2.AB8(VSS) U2.AB10(VSS) U2.AB12(VSS) U2.AB14(VSS) U2.AB16(VSS) U2.AB18(VSS) U2.AB20(VSS) U2.AB22(VSS) U2.AB23(VSS) U2.AB25(VSS) U2.AB27(VSS) U2.AB29(VSS) U2.AB31(VSS) U2.AB33(VSS) U2.AB35(VSS) U2.AB37(VSS) U2.AB39(VSS) U2.AB41(VSS) U2.AB43(VSS) U2.AC2(VSS) U2.AC4(VSS) U2.AC6(VSS) U2.AC8(VSS) U2.AC10(VSS) U2.AC12(VSS) U2.AC14(VSS) U2.AC16(VSS) U2.AC18(VSS) U2.AC20(VSS) U2.AC22(VSS) U2.AC23(VSS) U2.AC25(VSS) U2.AC29(VSS) U2.AC31(VSS) U2.AC33(VSS) U2.AC35(VSS) U2.AC37(VSS) U2.AC39(VSS) U2.AC41(VSS) U2.AC43(VSS) U2.AD1(VSS) U2.AD3(VSS) U2.AD5(VSS) U2.AD7(VSS) U2.AD9(VSS) U2.AD11(VSS) U2.AD13(VSS) U2.AD15(VSS) U2.AD17(VSS) U2.AD19(VSS) U2.AD21(VSS) U2.AD24(VSS) U2.AD26(VSS) U2.AD28(VSS) U2.AD30(VSS) U2.AD32(VSS) U2.AD34(VSS) U2.AD36(VSS) U2.AD38(VSS) U2.AD40(VSS) U2.AD42(VSS) U2.AD44(VSS) U2.AE2(VSS) U2.AE4(VSS) U2.AE6(VSS) U2.AE8(VSS) U2.AE10(VSS) U2.AE12(VSS) U2.AE14(VSS) U2.AE16(VSS) U2.AE18(VSS) U2.AE20(VSS) U2.AE22(VSS) U2.AE23(VSS) U2.AE25(VSS) U2.AE27(VSS) U2.AE29(VSS) U2.AE31(VSS) U2.AE33(VSS) U2.AE35(VSS) U2.AE37(VSS) U2.AE39(VSS) U2.AE41(VSS) U2.AE43(VSS) U2.AF1(VSS) U2.AF3(VSS) U2.AF5(VSS) U2.AF7(VSS) U2.AF9(VSS) U2.AF11(VSS) U2.AF13(VSS) U2.AF15(VSS) U2.AF17(VSS) U2.AF19(VSS) U2.AF21(VSS) U2.AF26(VSS) U2.AF30(VSS) U2.AF34(VSS) U2.AF36(VSS) U2.AF38(VSS) U2.AF40(VSS) U2.AF42(VSS) U2.AG2(VSS) U2.AG4(VSS) U2.AG6(VSS) U2.AG8(VSS) U2.AG10(VSS) U2.AG12(VSS) U2.AG14(VSS) U2.AG16(VSS) U2.AG18(VSS) U2.AG20(VSS) U2.AG22(VSS) U2.AG23(VSS) U2.AG25(VSS) U2.AG27(VSS) U2.AG29(VSS) U2.AG31(VSS) U2.AG33(VSS) U2.AG35(VSS) U2.AH1(VSS) U2.AH3(VSS) U2.AH5(VSS) U2.AH7(VSS) U2.AH9(VSS) U2.AH11(VSS) U2.AH13(VSS) U2.AH15(VSS) U2.AH17(VSS) U2.AH19(VSS) U2.AH21(VSS) U2.AH26(VSS) U2.AH28(VSS) U2.AH30(VSS) U2.AH32(VSS) U2.AH34(VSS) U2.AH40(VSS) U2.AJ2(VSS) U2.AJ4(VSS) U2.AJ6(VSS) U2.AJ8(VSS) U2.AJ10(VSS) U2.AJ12(VSS) U2.AJ14(VSS) U2.AJ16(VSS) U2.AJ18(VSS) U2.AJ20(VSS) U2.AJ22(VSS) U2.AJ25(VSS) U2.AJ29(VSS) U2.AJ31(VSS) U2.AJ33(VSS) U2.AJ35(VSS) U2.AJ37(VSS) U2.AJ39(VSS) U2.AJ41(VSS) U2.AJ43(VSS) U2.AK1(VSS) U2.AK3(VSS) U2.AK5(VSS) U2.AK7(VSS) U2.AK9(VSS) U2.AK11(VSS) U2.AK13(VSS) U2.AK15(VSS) U2.AK17(VSS) U2.AK19(VSS) U2.AK21(VSS) U2.AK24(VSS) U2.AK26(VSS) U2.AK28(VSS) U2.AK30(VSS) U2.AK32(VSS) U2.AK34(VSS) U2.AK36(VSS) U2.AK38(VSS) U2.AK42(VSS) U2.AK44(VSS) U2.AL2(VSS) U2.AL4(VSS) U2.AL6(VSS) U2.AL8(VSS) U2.AL10(VSS) U2.AL12(VSS) U2.AL14(VSS) U2.AL16(VSS) U2.AL18(VSS) U2.AL20(VSS) U2.AL22(VSS) U2.AL23(VSS) U2.AL25(VSS) U2.AL27(VSS) U2.AL29(VSS) U2.AL31(VSS) U2.AL33(VSS) U2.AL35(VSS) U2.AL37(VSS) U2.AL39(VSS) U2.AL41(VSS) U2.AL43(VSS) U2.AM1(VSS) U2.AM3(VSS) U2.AM5(VSS) U2.AM7(VSS) U2.AM9(VSS) U2.AM11(VSS) U2.AM13(VSS) U2.AM15(VSS) U2.AM17(VSS) U2.AM19(VSS) U2.AM21(VSS) U2.AM24(VSS) U2.AM26(VSS) U2.AM28(VSS) U2.AM30(VSS) U2.AM32(VSS) U2.AM34(VSS) U2.AM36(VSS) U2.AM38(VSS) U2.AM44(VSS) U2.AN2(VSS) U2.AN4(VSS) U2.AN6(VSS) U2.AN8(VSS) U2.AN14(VSS) U2.AN16(VSS) U2.AN18(VSS) U2.AN20(VSS) U2.AN22(VSS) U2.AN23(VSS) U2.AN25(VSS) U2.AN27(VSS) U2.AN29(VSS) U2.AN31(VSS) U2.AN33(VSS) U2.AN35(VSS) U2.AN37(VSS) U2.AN39(VSS) U2.AN41(VSS) U2.AN43(VSS) U2.AP1(VSS) U2.AP3(VSS) U2.AP5(VSS) U2.AP7(VSS) U2.AP9(VSS) U2.AP11(VSS) U2.AP13(VSS) U2.AP15(VSS) U2.AP17(VSS) U2.AP19(VSS) U2.AP21(VSS) U2.AP24(VSS) U2.AP26(VSS) U2.AP28(VSS) U2.AP30(VSS) U2.AP32(VSS) U2.AP34(VSS) U2.AP36(VSS) U2.AP38(VSS) U2.AP40(VSS) U2.AP42(VSS) U2.AP44(VSS) U2.AR2(VSS) U2.AR4(VSS) U2.AR6(VSS) U2.AR8(VSS) U2.AR12(VSS) U2.AR14(VSS) U2.AR16(VSS) U2.AR18(VSS) U2.AR20(VSS) U2.AR22(VSS) U2.AR23(VSS) U2.AR25(VSS) U2.AR27(VSS) U2.AR29(VSS) U2.AR31(VSS) U2.AR33(VSS) U2.AR35(VSS) U2.AR37(VSS) U2.AR39(VSS) U2.AR41(VSS) U2.AR43(VSS) U2.AT1(VSS) U2.AT3(VSS) U2.AT5(VSS) U2.AT7(VSS) U2.AT9(VSS) U2.AT11(VSS) U2.AT13(VSS) U2.AT15(VSS) U2.AT17(VSS) U2.AT19(VSS) U2.AT21(VSS) U2.AT24(VSS) U2.AT26(VSS) U2.AT28(VSS) U2.AT30(VSS) U2.AT32(VSS) U2.AT34(VSS) U2.AT36(VSS) U2.AT38(VSS) U2.AT40(VSS) U2.AT42(VSS) U2.AT44(VSS) U2.AU2(VSS) U2.AU4(VSS) U2.AU10(VSS) U2.AU16(VSS) U2.AU20(VSS) U2.AU23(VSS) U2.AU25(VSS) U2.AU27(VSS) U2.AU29(VSS) U2.AU31(VSS) U2.AU33(VSS) U2.AU35(VSS) U2.AU37(VSS) U2.AU39(VSS) U2.AU41(VSS) U2.AU43(VSS) U2.AV1(VSS) U2.AV3(VSS) U2.AV5(VSS) U2.AV15(VSS) U2.AV19(VSS) U2.AV21(VSS) U2.AV24(VSS) U2.AV26(VSS) U2.AV28(VSS) U2.AV30(VSS) U2.AV32(VSS) U2.AV34(VSS) U2.AV36(VSS) U2.AV38(VSS) U2.AV40(VSS) U2.AV42(VSS) U2.AV44(VSS) U2.AW4(VSS) U2.AW6(VSS) U2.AW8(VSS) U2.AW10(VSS) U2.AW12(VSS) U2.AW16(VSS) U2.AW18(VSS) U2.AW20(VSS) U2.AW22(VSS) U2.AW23(VSS) U2.AW25(VSS) U2.AW27(VSS) U2.AW29(VSS) U2.AW31(VSS) U2.AW33(VSS) U2.AW35(VSS) U2.AW37(VSS) U2.AW39(VSS) U2.AW41(VSS) U2.AW43(VSS) U2.AY1(VSS) U2.AY3(VSS) U2.AY5(VSS) U2.AY7(VSS) U2.AY9(VSS) U2.AY11(VSS) U2.AY13(VSS) U2.AY15(VSS) U2.AY19(VSS) U2.AY24(VSS) U2.AY26(VSS) U2.AY28(VSS) U2.AY30(VSS) U2.AY32(VSS) U2.AY34(VSS) U2.AY36(VSS) U2.AY38(VSS) U2.AY40(VSS) U2.AY42(VSS) U2.AY44(VSS) U2.B2(VSS) U2.B4(VSS) U2.B6(VSS) U2.B8(VSS) U2.B22(VSS) U2.B23(VSS) U2.B37(VSS) U2.B39(VSS) U2.B41(VSS) U2.B43(VSS) U2.BA2(VSS) U2.BA4(VSS) U2.BA6(VSS) U2.BA8(VSS) U2.BA10(VSS) U2.BA12(VSS) U2.BA14(VSS) U2.BA16(VSS) U2.BA18(VSS) U2.BA20(VSS) U2.BA22(VSS) U2.BA23(VSS) U2.BA25(VSS) U2.BA27(VSS) U2.BA29(VSS) U2.BA31(VSS) U2.BA33(VSS) U2.BA35(VSS) U2.BA37(VSS) U2.BA39(VSS) U2.BA41(VSS) U2.BA43(VSS) U2.BB1(VSS) U2.BB3(VSS) U2.BB5(VSS) U2.BB7(VSS) U2.BB24(VSS) U2.BB38(VSS) U2.BB40(VSS) U2.BB42(VSS) U2.BB44(VSS) U2.BC2(VSS) U2.BC4(VSS) U2.BC6(VSS) U2.BC8(VSS) U2.BC22(VSS) U2.BC23(VSS) U2.BC37(VSS) U2.BC39(VSS) U2.BC41(VSS) U2.BC43(VSS) U2.BD1(VSS) U2.BD3(VSS) U2.BD7(VSS) U2.BD38(VSS) U2.BD40(VSS) U2.BD42(VSS) U2.BD44(VSS) U2.C1(VSS) U2.C3(VSS) U2.C5(VSS) U2.C7(VSS) U2.C21(VSS) U2.C36(VSS) U2.C38(VSS) U2.C40(VSS) U2.C42(VSS) U2.C44(VSS) U2.D2(VSS) U2.D4(VSS) U2.D6(VSS) U2.D8(VSS) U2.D10(VSS) U2.D12(VSS) U2.D14(VSS) U2.D16(VSS) U2.D18(VSS) U2.D20(VSS) U2.D22(VSS) U2.D23(VSS) U2.D25(VSS) U2.D27(VSS) U2.D29(VSS) U2.D31(VSS) U2.D33(VSS) U2.D35(VSS) U2.D37(VSS) U2.D39(VSS) U2.D41(VSS) U2.D43(VSS) U2.E1(VSS) U2.E3(VSS) U2.E5(VSS) U2.E7(VSS) U2.E9(VSS) U2.E11(VSS) U2.E13(VSS) U2.E15(VSS) U2.E17(VSS) U2.E19(VSS) U2.E21(VSS) U2.E24(VSS) U2.E26(VSS) U2.E28(VSS) U2.E30(VSS) U2.E32(VSS) U2.E34(VSS) U2.E36(VSS) U2.E38(VSS) U2.E40(VSS) U2.E42(VSS) U2.E44(VSS) U2.F2(VSS) U2.F4(VSS) U2.F6(VSS) U2.F8(VSS) U2.F10(VSS) U2.F12(VSS) U2.F14(VSS) U2.F16(VSS) U2.F18(VSS) U2.F20(VSS) U2.F22(VSS) U2.F23(VSS) U2.F25(VSS) U2.F27(VSS) U2.F29(VSS) U2.F31(VSS) U2.F33(VSS) U2.F35(VSS) U2.F37(VSS) U2.F39(VSS) U2.F41(VSS) U2.F43(VSS) U2.G1(VSS) U2.G3(VSS) U2.G5(VSS) U2.G7(VSS) U2.G9(VSS) U2.G11(VSS) U2.G13(VSS) U2.G15(VSS) U2.G17(VSS) U2.G19(VSS) U2.G21(VSS) U2.G24(VSS) U2.G26(VSS) U2.G28(VSS) U2.G30(VSS) U2.G32(VSS) U2.G34(VSS) U2.G36(VSS) U2.G38(VSS) U2.G40(VSS) U2.G42(VSS) U2.G44(VSS) U2.H2(VSS) U2.H4(VSS) U2.H6(VSS) U2.H8(VSS) U2.H10(VSS) U2.H12(VSS) U2.H14(VSS) U2.H16(VSS) U2.H18(VSS) U2.H20(VSS) U2.H22(VSS) U2.H23(VSS) U2.H25(VSS) U2.H27(VSS) U2.H29(VSS) U2.H31(VSS) U2.H33(VSS) U2.H35(VSS) U2.H37(VSS) U2.H39(VSS) U2.H41(VSS) U2.H43(VSS) U2.J1(VSS) U2.J3(VSS) U2.J5(VSS) U2.J7(VSS) U2.J9(VSS) U2.J11(VSS) U2.J13(VSS) U2.J15(VSS) U2.J17(VSS) U2.J19(VSS) U2.J21(VSS) U2.J24(VSS) U2.J26(VSS) U2.J28(VSS) U2.J30(VSS) U2.J32(VSS) U2.J34(VSS) U2.J36(VSS) U2.J38(VSS) U2.J40(VSS) U2.J42(VSS) U2.J44(VSS) U2.K2(VSS) U2.K4(VSS) U2.K6(VSS) U2.K8(VSS) U2.K10(VSS) U2.K12(VSS) U2.K14(VSS) U2.K16(VSS) U2.K18(VSS) U2.K20(VSS) U2.K22(VSS) U2.K23(VSS) U2.K25(VSS) U2.K27(VSS) U2.K29(VSS) U2.K31(VSS) U2.K33(VSS) U2.K35(VSS) U2.K37(VSS) U2.K39(VSS) U2.K41(VSS) U2.K43(VSS) U2.L1(VSS) U2.L3(VSS) U2.L5(VSS) U2.L7(VSS) U2.L9(VSS) U2.L11(VSS) U2.L13(VSS) U2.L15(VSS) U2.L17(VSS) U2.L19(VSS) U2.L21(VSS) U2.L24(VSS) U2.L26(VSS) U2.L28(VSS) U2.L30(VSS) U2.L32(VSS) U2.L34(VSS) U2.L36(VSS) U2.L38(VSS) U2.L40(VSS) U2.L42(VSS) U2.L44(VSS) U2.M2(VSS) U2.M4(VSS) U2.M6(VSS) U2.M8(VSS) U2.M10(VSS) U2.M12(VSS) U2.M14(VSS) U2.M16(VSS) U2.M18(VSS) U2.M20(VSS) U2.M22(VSS) U2.M23(VSS) U2.M25(VSS) U2.M27(VSS) U2.M29(VSS) U2.M31(VSS) U2.M33(VSS) U2.M35(VSS) U2.M37(VSS) U2.M39(VSS) U2.M41(VSS) U2.M43(VSS) U2.N1(VSS) U2.N3(VSS) U2.N5(VSS) U2.N7(VSS) U2.N9(VSS) U2.N11(VSS) U2.N13(VSS) U2.N15(VSS) U2.N17(VSS) U2.N19(VSS) U2.N21(VSS) U2.N24(VSS) U2.N26(VSS) U2.N28(VSS) U2.N30(VSS) U2.N32(VSS) U2.N34(VSS) U2.N36(VSS) U2.N38(VSS) U2.N40(VSS) U2.N42(VSS) U2.N44(VSS) U2.P2(VSS) U2.P4(VSS) U2.P6(VSS) U2.P8(VSS) U2.P10(VSS) U2.P12(VSS) U2.P14(VSS) U2.P16(VSS) U2.P18(VSS) U2.P20(VSS) U2.P22(VSS) U2.P23(VSS) U2.P25(VSS) U2.P27(VSS) U2.P29(VSS) U2.P31(VSS) U2.P33(VSS) U2.P35(VSS) U2.P37(VSS) U2.P39(VSS) U2.P41(VSS) U2.P43(VSS) U2.R1(VSS) U2.R3(VSS) U2.R5(VSS) U2.R7(VSS) U2.R9(VSS) U2.R11(VSS) U2.R13(VSS) U2.R15(VSS) U2.R17(VSS) U2.R19(VSS) U2.R21(VSS) U2.R24(VSS) U2.R26(VSS) U2.R28(VSS) U2.R30(VSS) U2.R32(VSS) U2.R34(VSS) U2.R36(VSS) U2.R38(VSS) U2.R40(VSS) U2.R42(VSS) U2.R44(VSS) U2.T2(VSS) U2.T4(VSS) U2.T6(VSS) U2.T8(VSS) U2.T10(VSS) U2.T12(VSS) U2.T14(VSS) U2.T16(VSS) U2.T18(VSS) U2.T20(VSS) U2.T22(VSS) U2.T23(VSS) U2.T25(VSS) U2.T27(VSS) U2.T29(VSS) U2.T31(VSS) U2.T33(VSS) U2.T35(VSS) U2.T37(VSS) U2.T39(VSS) U2.T41(VSS) U2.T43(VSS) U2.U1(VSS) U2.U3(VSS) U2.U5(VSS) U2.U7(VSS) U2.U9(VSS) U2.U11(VSS) U2.U13(VSS) U2.U15(VSS) U2.U17(VSS) U2.U19(VSS) U2.U21(VSS) U2.U24(VSS) U2.U26(VSS) U2.U28(VSS) U2.U30(VSS) U2.U32(VSS) U2.U34(VSS) U2.U36(VSS) U2.U38(VSS) U2.U40(VSS) U2.U42(VSS) U2.U44(VSS) U2.V2(VSS) U2.V4(VSS) U2.V6(VSS) U2.V8(VSS) U2.V10(VSS) U2.V12(VSS) U2.V14(VSS) U2.V16(VSS) U2.V18(VSS) U2.V20(VSS) U2.V22(VSS) U2.V23(VSS) U2.V25(VSS) U2.V27(VSS) U2.V29(VSS) U2.V31(VSS) U2.V33(VSS) U2.V35(VSS) U2.V37(VSS) U2.V39(VSS) U2.V41(VSS) U2.V43(VSS) U2.W1(VSS) U2.W3(VSS) U2.W5(VSS) U2.W7(VSS) U2.W9(VSS) U2.W11(VSS) U2.W13(VSS) U2.W15(VSS) U2.W17(VSS) U2.W19(VSS) U2.W21(VSS) U2.W24(VSS) U2.W26(VSS) U2.W28(VSS) U2.W30(VSS) U2.W32(VSS) U2.W34(VSS) U2.W36(VSS) U2.W38(VSS) U2.W40(VSS) U2.W42(VSS) U2.W44(VSS) U2.Y2(VSS) U2.Y4(VSS) U2.Y6(VSS) U2.Y8(VSS) U2.Y10(VSS) U2.Y12(VSS) U2.Y14(VSS) U2.Y16(VSS) U2.Y18(VSS) U2.Y20(VSS) U2.Y22(VSS) U2.Y23(VSS) U2.Y25(VSS) U2.Y27(VSS) U2.Y29(VSS) U2.Y31(VSS) U2.Y33(VSS) U2.Y35(VSS) U2.Y37(VSS) U2.Y39(VSS) U2.Y41(VSS) U2.Y43(VSS) ; port GND
NetU2_AC24: U2.AC24(VDD_D3) U2.BD2(VDD_D4)
NetU2_AC26: U2.AC26(VDD_D3) U2.BD4(VDD_D4)
NetU2_AC27: U2.AC27(VSS) U2.BD5(VSS)
NetU2_AC28: U2.AC28(VDD_D3) U2.BD6(VDD_D4)
NetU2_AC30: U2.AC30(VDD_D3) U2.BD22(VDD_D4)
NetU2_AC34: U2.AC34(VDD_D3) U2.BC1(VDD_D4)
NetU2_AC36: U2.AC36(VDD_D3) U2.BC3(VDD_D4)
NetU2_AC38: U2.AC38(VDD_D3) U2.BC5(VDD_D4)
NetU2_AC40: U2.AC40(VDD_D3) U2.BC7(VDD_D4)
NetU2_AC44: U2.AC44(VDD_D3) U2.BB2(VDD_D4)
NetU2_AD23: U2.AD23(VDD_D3) U2.BB6(VDD_D4)
NetU2_AD25: U2.AD25(VDD_D3) U2.BB8(VDD_D4)
NetU2_AD27: U2.AD27(VDD_D3) U2.BB22(VDD_D4)
NetU2_AD31: U2.AD31(VDD_D3) U2.BA1(VDD_D4)
NetU2_AD33: U2.AD33(VDD_D3) U2.BA3(VDD_D4)
NetU2_AD35: U2.AD35(VDD_D3) U2.BA5(VDD_D4)
NetU2_AD37: U2.AD37(VDD_D3) U2.BA7(VDD_D4)
NetU2_AD39: U2.AD39(VDD_D3) U2.BA9(VDD_D4)
NetU2_AD41: U2.AD41(VDD_D3) U2.BA11(VDD_D4)
NetU2_AD43: U2.AD43(VDD_D3) U2.BA13(VDD_D4)
NetU2_AE24: U2.AE24(VDD_D3) U2.BA17(VDD_D4)
NetU2_AE26: U2.AE26(VDD_D3) U2.BA19(VDD_D4)
NetU2_AE28: U2.AE28(VDD_D3) U2.BA21(VDD_D4)
NetU2_AE32: U2.AE32(VDD_D3) U2.AY2(VDD_D4)
NetU2_AE34: U2.AE34(VDD_D3) U2.AY4(VDD_D4)
NetU2_AE36: U2.AE36(VDD_D3) U2.AY6(VDD_D4)
NetU2_AE38: U2.AE38(VDD_D3) U2.AY8(VDD_D4)
NetU2_AE40: U2.AE40(VDD_D3) U2.AY10(VDD_D4)
NetU2_AE42: U2.AE42(VDD_D3) U2.AY12(VDD_D4)
NetU2_AE44: U2.AE44(VDD_D3) U2.AY14(VDD_D4)
NetU2_AF23: U2.AF23(VDD_D3) U2.AY18(VDD_D4)
NetU2_AF24: U2.AF24(VSS) U2.AY17(VSS)
NetU2_AF25: U2.AF25(VDD_D3) U2.AY20(VDD_D4)
NetU2_AF27: U2.AF27(VDD_D3) U2.AY22(VDD_D4)
NetU2_AF28: U2.AF28(VSS) U2.AY21(VSS)
NetU2_AF31: U2.AF31(VDD_D3) U2.AW1(VDD_D4)
NetU2_AF32: U2.AF32(VSS) U2.AW2(VSS)
NetU2_AF33: U2.AF33(VDD_D3) U2.AW3(VDD_D4)
NetU2_AF35: U2.AF35(VDD_D3) U2.AW5(VDD_D4)
NetU2_AF37: U2.AF37(VDD_D3) U2.AW7(VDD_D4)
NetU2_AF39: U2.AF39(VDD_D3) U2.AW9(VDD_D4)
NetU2_AF41: U2.AF41(VDD_D3) U2.AW11(VDD_D4)
NetU2_AF43: U2.AF43(VDD_D3) U2.AW13(VDD_D4)
NetU2_AF44: U2.AF44(VSS) U2.AW14(VSS)
NetU2_AG24: U2.AG24(VDD_D3) U2.AW17(VDD_D4)
NetU2_AG26: U2.AG26(VDD_D3) U2.AW19(VDD_D4)
NetU2_AG28: U2.AG28(VDD_D3) U2.AW21(VDD_D4)
NetU2_AG32: U2.AG32(VDD_D3) U2.AV2(VDD_D4)
NetU2_AG34: U2.AG34(VDD_D3) U2.AV4(VDD_D4)
NetU2_AG36: U2.AG36(VDD_D3) U2.AV6(VDD_D4)
NetU2_AG37: U2.AG37(VSS) U2.AV7(VSS)
NetU2_AG38: U2.AG38(VDD_D3) U2.AV8(VDD_D4)
NetU2_AG39: U2.AG39(VSS) U2.AV9(VSS)
NetU2_AG40: U2.AG40(VDD_D3) U2.AV10(VDD_D4)
NetU2_AG41: U2.AG41(VSS) U2.AV11(VSS)
NetU2_AG42: U2.AG42(VDD_D3) U2.AV12(VDD_D4)
NetU2_AG43: U2.AG43(VSS) U2.AV13(VSS)
NetU2_AG44: U2.AG44(VDD_D3) U2.AV14(VDD_D4)
NetU2_AH23: U2.AH23(VDD_D3) U2.AV18(VDD_D4)
NetU2_AH24: U2.AH24(VSS) U2.AV17(VSS)
NetU2_AH25: U2.AH25(VDD_D3) U2.AV20(VDD_D4)
NetU2_AH27: U2.AH27(VDD_D3) U2.AV22(VDD_D4)
NetU2_AH31: U2.AH31(VDD_D3) U2.AU1(VDD_D4)
NetU2_AH33: U2.AH33(VDD_D3) U2.AU3(VDD_D4)
NetU2_AH35: U2.AH35(VDD_D3) U2.AU5(VDD_D4)
NetU2_AH36: U2.AH36(VSS) U2.AU6(VSS)
NetU2_AH37: U2.AH37(VDD_D3) U2.AU7(VDD_D4)
NetU2_AH38: U2.AH38(VSS) U2.AU8(VSS)
NetU2_AH39: U2.AH39(VDD_D3) U2.AU9(VDD_D4)
NetU2_AH41: U2.AH41(VDD_D3) U2.AU11(VDD_D4)
NetU2_AH42: U2.AH42(VSS) U2.AU12(VSS)
NetU2_AH43: U2.AH43(VDD_D3) U2.AU13(VDD_D4)
NetU2_AH44: U2.AH44(VSS) U2.AU14(VSS)
NetU2_AJ23: U2.AJ23(VSS) U2.AU18(VSS)
NetU2_AJ24: U2.AJ24(VDD_D3) U2.AU17(VDD_D4)
NetU2_AJ26: U2.AJ26(VDD_D3) U2.AU19(VDD_D4)
NetU2_AJ27: U2.AJ27(VSS) U2.AU22(VSS)
NetU2_AJ28: U2.AJ28(VDD_D3) U2.AU21(VDD_D4)
NetU2_AJ32: U2.AJ32(VDD_D3) U2.AT2(VDD_D4)
NetU2_AJ34: U2.AJ34(VDD_D3) U2.AT4(VDD_D4)
NetU2_AJ36: U2.AJ36(VDD_D3) U2.AT6(VDD_D4)
NetU2_AJ38: U2.AJ38(VDD_D3) U2.AT8(VDD_D4)
NetU2_AJ40: U2.AJ40(VDD_D3) U2.AT10(VDD_D4)
NetU2_AJ42: U2.AJ42(VDD_D3) U2.AT12(VDD_D4)
NetU2_AJ44: U2.AJ44(VDD_D3) U2.AT14(VDD_D4)
NetU2_AK23: U2.AK23(VDD_D3) U2.AT18(VDD_D4)
NetU2_AK27: U2.AK27(VDD_D3) U2.AT22(VDD_D4)
NetU2_AK31: U2.AK31(VDD_D3) U2.AR1(VDD_D4)
NetU2_AK33: U2.AK33(VDD_D3) U2.AR3(VDD_D4)
NetU2_AK35: U2.AK35(VDD_D3) U2.AR5(VDD_D4)
NetU2_AK37: U2.AK37(VDD_D3) U2.AR7(VDD_D4)
NetU2_AK39: U2.AK39(VDD_D3) U2.AR9(VDD_D4)
NetU2_AK40: U2.AK40(VSS) U2.AR10(VSS)
NetU2_AK41: U2.AK41(VDD_D3) U2.AR11(VDD_D4)
NetU2_AK43: U2.AK43(VDD_D3) U2.AR13(VDD_D4)
NetU2_AL24: U2.AL24(VDD_D3) U2.AR17(VDD_D4)
NetU2_AL26: U2.AL26(VDD_D3) U2.AR19(VDD_D4)
NetU2_AL28: U2.AL28(VDD_D3) U2.AR21(VDD_D4)
NetU2_AL32: U2.AL32(VDD_D3) U2.AP2(VDD_D4)
NetU2_AL34: U2.AL34(VDD_D3) U2.AP4(VDD_D4)
NetU2_AL36: U2.AL36(VDD_D3) U2.AP6(VDD_D4)
NetU2_AL38: U2.AL38(VDD_D3) U2.AP8(VDD_D4)
NetU2_AL40: U2.AL40(VDD_D3) U2.AP10(VDD_D4)
NetU2_AL42: U2.AL42(VDD_D3) U2.AP12(VDD_D4)
NetU2_AL44: U2.AL44(VDD_D3) U2.AP14(VDD_D4)
NetU2_AM23: U2.AM23(VDD_D3) U2.AP18(VDD_D4)
NetU2_AM25: U2.AM25(VDD_D3) U2.AP20(VDD_D4)
NetU2_AM27: U2.AM27(VDD_D3) U2.AP22(VDD_D4)
NetU2_AM31: U2.AM31(VDD_D3) U2.AN1(VDD_D4)
NetU2_AM33: U2.AM33(VDD_D3) U2.AN3(VDD_D4)
NetU2_AM35: U2.AM35(VDD_D3) U2.AN5(VDD_D4)
NetU2_AM37: U2.AM37(VDD_D3) U2.AN7(VDD_D4)
NetU2_AM39: U2.AM39(VDD_D3) U2.AN9(VDD_D4)
NetU2_AM40: U2.AM40(VSS) U2.AN10(VSS)
NetU2_AM41: U2.AM41(VDD_D3) U2.AN11(VDD_D4)
NetU2_AM42: U2.AM42(VSS) U2.AN12(VSS)
NetU2_AM43: U2.AM43(VDD_D3) U2.AN13(VDD_D4)
NetU2_AY27: U2.AY27(VDD_D3) U2.E27(VDD_D2)

## Notes on the sheet
- Block Name
- Document Type: Schematic
- Size
- File Name
- Variant
- Rev.
- Project Name
- Sheet
- /

## Library data of the parts
C267-C306 = CAP000028169: DB_PART_TYPE: Ceramic_SMD\Standard_X7R; DB_MANUFACTURER_PART: KEMET    C0603C474J4RAC; NOTE: <NOTE>; DB_T_RANGE: -55 to 125; DB_PACKAGE: 0603; DB_DESCRIPTION: C X7R 470nF 5% 16V 0603; DB_STATUS: NEW; DB_PART_NUMBER: CAP000028169; DB_PCB_DEVICE: SMD_0603_CAPC1608X95N; DB_APPROVED_ON: 09.10.2010; DB_DATASHEET: http://john.epiqdesign.com/projects/CIS_Datasheets/F3102_CE_Kemet.pdf?rev=92&sc=0
C307-C346 = CAP000047355: DB_PART_TYPE: Ceramic_SMD\Standard_X5R; DB_MANUFACTURER_PART: SAMSUNG    CL32A227MQVNNNE; NOTE: <NOTE>; DB_T_RANGE: -55 to 85; DB_PACKAGE: 1210; DB_DESCRIPTION: C X5R 220uF 20% 6.3V 1210; DB_APPROVED_BY: VSN; DB_STATUS: NEW; DB_PART_NUMBER: CAP000047355; DB_PCB_DEVICE: SMD_1210_CAPC3225X279N; DB_APPROVED_ON: 07.05.2014 11:28:08; DB_DATASHEET: http://john.epiqdesign.com/projects/CIS_Datasheets/CAP_CL32A227MQVNNNE.pdf?rev=1401&sc=0